# EAGLE design idealdiode (EAGLE 9.6.2)
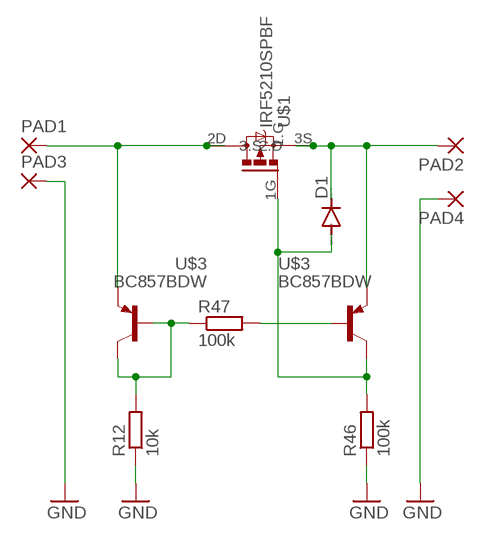
[diagram p0: schematic, sheet 1]

## Parts
D1  DIODE-SMB  [SMB]
PAD1  2,54/1,0  [2,54/1,0]
PAD2  2,54/1,0  [2,54/1,0]
PAD3  2,54/1,0  [2,54/1,0]
PAD4  2,54/1,0  [2,54/1,0]
R12  10k  R-EU_R0603  [R0603]
R46  100k  R-EU_R0603  [R0603]
R47  100k  R-EU_R0603  [R0603]
U$1  IRF5210SPBF  [TO-220SMD]
U$3  BC857BDW  [SOT363-INFINION]

## Nets
GND: PAD3.1(P) PAD4.1(P) R12.1 R46.1
N$20: D1.A R46.2 U$1.1G(1.G) U$3.3(C)
N$34: R12.2 R47.1 U$3.2(B1) U$3.6(C1)
N$40: R47.2 U$3.5(B)
N$43: D1.C PAD2.1(P) U$1.3S(3.S) U$3.4(E)
N$52: PAD1.1(P) U$1.2D(2.D) U$3.1(E1)

## Library data of the parts
D1 = diode:DIODE-: DIODE
PAD1-PAD4 = wirepad:2,54/1,0: THROUGH-HOLE PAD
R12 R46 R47 = rcl:R-EU_: RESISTOR, European symbol; SPICEPREFIX: R
U$1 = irf5210spbf:IRF5210SPBF
U$3 = bc857bdw:BC857BDW

## Board
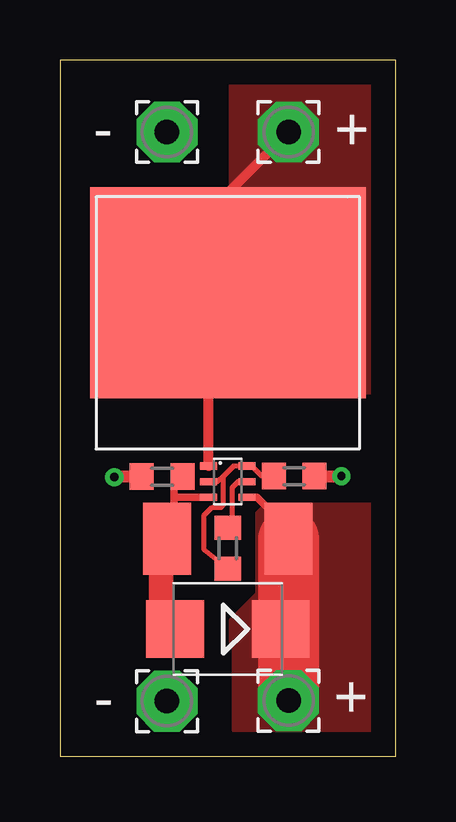
[diagram p1: board, top side]
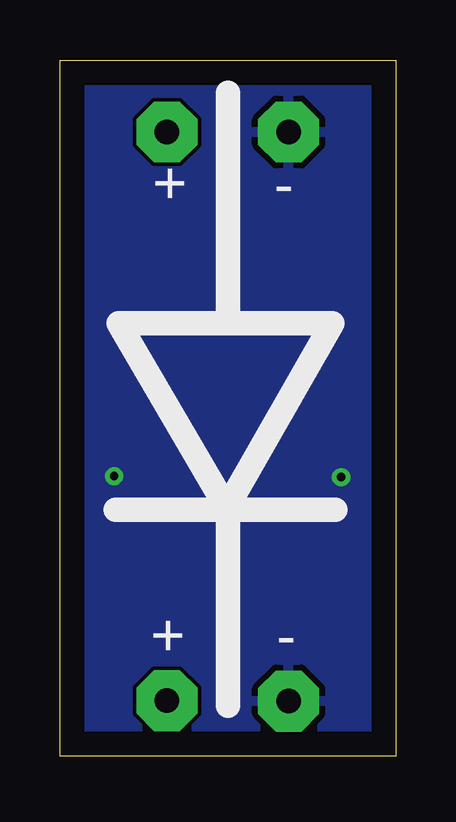
[diagram p2: board, bottom side, seen from below]

Size 14 x 29 mm. Coordinates in mm from the lower left corner, seen from the top.
Outline: 0,0 14,0 14,29 0,29 0,0
Copper layers (1*16): Top 0.035mm / dielectric 1.5mm / Bottom 0.035mm
Design rules "default": minimum track width 6mil, minimum drill 0.35mm, track to track 6mil, track to pad 6mil, pad to pad 6mil, via to via 6mil, smd to smd 6mil, copper to edge 40mil, drill to drill 6mil, minimum pad ring 10mil, minimum via ring 8mil, stop-mask expansion 4mil, vias tented up to drill 0mil, thermal gap 10mil

### Footprints (pad centres in the part's own frame; a part is rotated, then mirrored left to right if it is on the bottom)
SMB = smd 2.4 x 2.4: A 2.2,0; C -2.2,0
2,54/1,0 = drill 1.016 pad 2.54 octagon: 1 0,0
R0603 = smd 1 x 1.1: 1 -0.85,0; 2 0.85,0
TO-220SMD = smd 2 x 3: 1G -2.54,-10.25; 3S 2.54,-10.25 | smd 11.5 x 8.8: 2D 0,0
SOT363-INFINION = smd 0.3 x 0.7: 1 -0.65,-0.8; 2 0,-0.8; 3 0.65,-0.8; 4 0.65,0.8; 5 0,0.8; 6 -0.65,0.8

### Placement (x,y rotation side)
D1  7,5.29 180 top
PAD1  9.54,26 0 top
PAD2  9.54,2.31 0 top
PAD3  4.46,26 0 top
PAD4  4.46,2.29 0 top
R12  9.77,11.66 180 top
R46  4.26,11.64 0 top
R47  7,8.66 90 top
U$1  7,19.3 0 top
U$3  7,11.43 270 top

### Tracks (layer width: path | path; a pad name or v marks a point on that pad's centre or on a via)
GND  (via drill 0.35)
  Top 0.508: R46.1 2.29,11.64 v2.27,11.62 | R12.1 v11.74,11.66
  pour Bottom: 0.31,28.74 13.78,28.74 13.78,0.21 0.21,0.21 0.21,28.64
N$20
  Top 0.305: U$3.3 4.75,10.78 | R46.2 4.75,11.28 4.75,10.78 | 4.75,10.78 4.75,9.63 4.22,9.11 | 4.22,8.91 U$1.1G
  Top 1.016: D1.A 4.22,5.59 4.22,8.91 4.22,9.11
N$34
  Top 0.2: R12.2 8.43,11.66 8.01,12.08 U$3.6 7.23,12.08 6.82,11.66 | 6.82,11.66 6.58,11.43 U$3.2 | R47.1 6.02,8.59 6.02,10.04 6.34,10.36 6.72,10.36 6.82,10.45 6.82,11.66
N$40
  Top 0.2: R47.2 7.19,9.51 7.19,11.2 7.42,11.43 7.57,11.43 U$3.5
N$43
  Top 0.305: U$3.4 8.21,10.78 9.44,9.55 U$1.3S
  Top 2.54: U$1.3S 9.54,2.65 PAD2.1
  pour Top (no thermals): 7.19,4.78 7.19,5.63 8.31,6.75 8.31,10.09 8.63,10.41 13.18,10.41 13.74,9.85 13.74,0.02 8.41,0.02 7.33,1.1 7.33,4.64
N$52
  Top 0.406: 7.81,19.82 7.52,19.82 | U$3.1 6.2,22.66 PAD1.1
  pour Top (no thermals): 7.39,28.8 13.01,28.8 13.76,28.05 13.76,15.58 13.4,15.22 7.84,15.22 7.2,15.86 7.2,28.61

### Text on the board
tPlace: - | + | - | +
bPlace: - | + | - | +